# Altium project XDRONE.PrjPcb
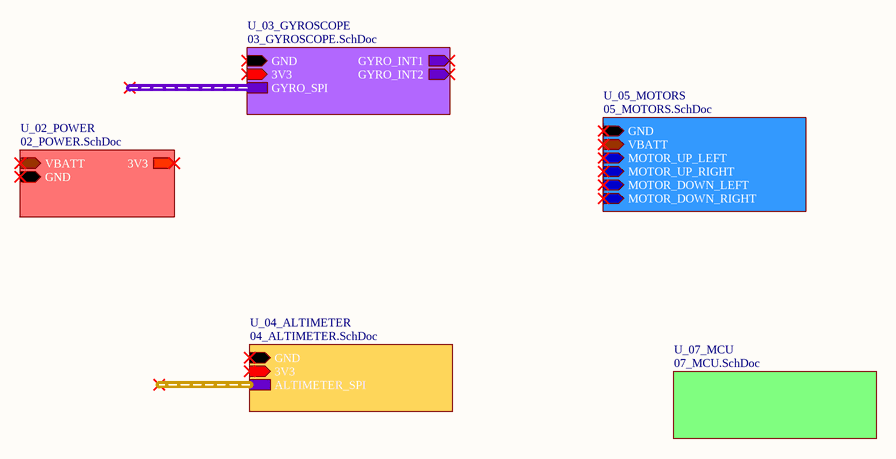
[diagram p0: 01_XDRONE.SchDoc]
5 sheets, 35 parts. Net scope: hierarchical (ports join the sheet entries above them; power ports are global).
Sheets:
  01_XDRONE.SchDoc
    U_02_POWER = 02_POWER.SchDoc
    U_05_MOTORS = 05_MOTORS.SchDoc
    U_03_GYROSCOPE = 03_GYROSCOPE.SchDoc
    U_04_ALTIMETER = 04_ALTIMETER.SchDoc

## Sheet 01_XDRONE.SchDoc: XDRONE
size A4; Author: Gabriel; Organization: Altium Limited; Address1: L3, 12a Rodborough Rd; Address2: Frenchs Forest; Address3: NSW; Address4: Australia 2086; SheetNumber: 1; SheetTotal: 1; Subtitle: Main

### Sub-sheets
U_02_POWER = 02_POWER.SchDoc: VBATT (in), GND (in), 3V3 (out)
U_03_GYROSCOPE = 03_GYROSCOPE.SchDoc: GND (in), 3V3 (in), GYRO_INT1 (out), GYRO_INT2 (out), GYRO_SPI (harness GYRO_SPI)
U_04_ALTIMETER = 04_ALTIMETER.SchDoc: GND (in), 3V3 (in), ALTIMETER_SPI (harness ALTIMETER_SPI)
U_05_MOTORS = 05_MOTORS.SchDoc: GND (in), VBATT (in), MOTOR_UP_LEFT (in), MOTOR_UP_RIGHT (in), MOTOR_DOWN_LEFT (in), MOTOR_DOWN_RIGHT (in)
U_07_MCU = 07_MCU.SchDoc (file not in this document): no entries

### Nets
3V3: sheet U_03_GYROSCOPE/3V3, sheet U_04_ALTIMETER/3V3
GND: sheet U_02_POWER/GND, sheet U_05_MOTORS/GND, sheet U_03_GYROSCOPE/GND, sheet U_04_ALTIMETER/GND

### Notes on the sheet
- TITLE:
- CREATED BY
- MODIFIED DATE
- PAGE
- /

## Sheet 02_POWER.SchDoc: POWER
size A4; Author: Gabriel; Organization: Altium Limited; Address1: L3, 12a Rodborough Rd; Address2: Frenchs Forest; Address3: NSW; Address4: Australia 2086; SheetNumber: 2; SheetTotal: 1; Subtitle: XDRONE
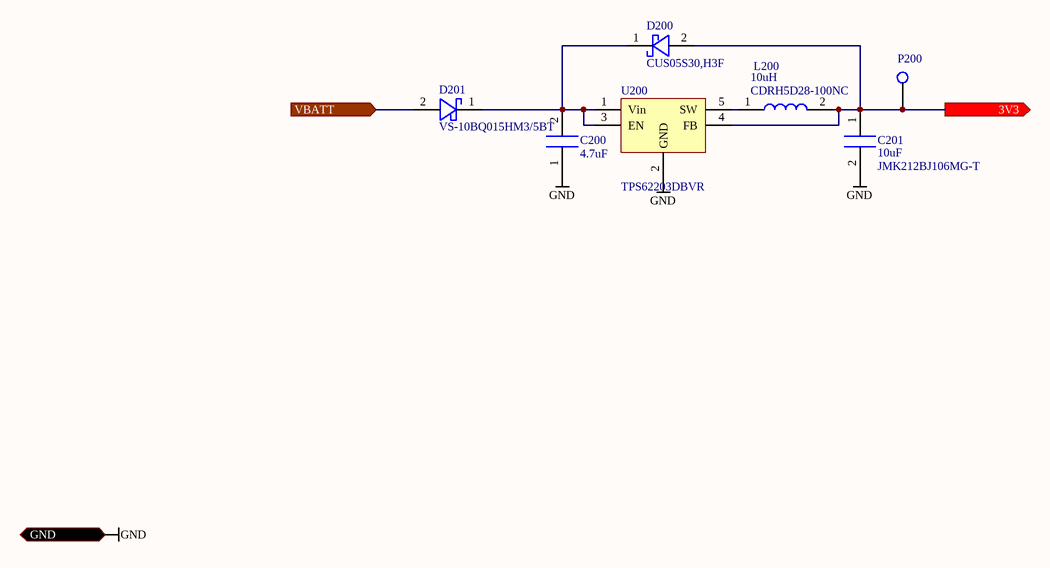
[diagram p1: 02_POWER.SchDoc]

### Parts
C200  value 4.7uF  [CAP_0805]  (hidden comment: 4.7uF_10%_16V_0805_X7R_GRM21BR71C475KE51L)
C201  value 10uF  MANUFACTURER REFERENCE: JMK212BJ106MG-T  [CAP_0805]  (hidden comment: 10uF_20%_6.3V_0805_X5R_JMK212BJ106MG-T)
D200  MANUFACTURER REFERENCE: CUS05S30,H3F  [SOD-323]  (hidden comment: DIODE_30V_500mA_340mVf_CUS05S30,H3F)
D201  MANUFACTURER REFERENCE: VS-10BQ015HM3/5BT  (hidden comment: DIODE_15V_1A_210mVf_VS-10BQ015HM3/5BT)
L200  value 10uH  [CDRH5D28-100NC]  (hidden comment: 10uH_30%_1.3A_CDRH5D28-100NC)
P200  TEST_POINT_2mm  [TEST_POINT_2mm]  (value not drawn)
U200  MANUFACTURER REFERENCE: TPS62203DBVR  [SC-74A-5 SOT-23-5]  (hidden comment: DCDC_6VIN_3.3VOUT_600mA_TPS62203DBVR)

### Ports
3V3 (out), GND (in), VBATT (in)

### Nets
GND: C200.1 C201.2 U200.2(GND) ; port GND
NetC200_2: C200.2 D200.1 D201.1 U200.1(Vin) U200.3(EN)
NetC201_1: C201.1 D200.2 L200.2 P200.1 U200.4(FB) ; port 3V3
NetD201_2: D201.2 ; port VBATT
NetL200_1: L200.1 U200.5(SW)

### Notes on the sheet
- TITLE:
- CREATED BY
- MODIFIED DATE
- PAGE
- /

### Library data of the parts
C200 = 4.7uF_10%_16V_0805_X7R_GRM21BR71C475KE51L: CAP 4.7uF 10% 106 0805 X7R; MANUFACTURER: MURATA; VOLTAGE RATING: 16V; DIELECTRIC: X7R; TOLERANCE: 10%; PACKAGING: 0805; MOUNTING: SMD; MANUFACTURER REFERENCE: GRM21BR71C475KE51L
C201 = 10uF_20%_6.3V_0805_X5R_JMK212BJ106MG-T: CAP 10uF 20% 6.3V 0805 X5R; MANUFACTURER: TAYIO YUDEN; DIELECTRIC: X5R; TOLERANCE: 20%; VOLTAGE RATING: 6.3V; PACKAGING: 0805; MOUNTING: SMD
D200 = DIODE_30V_500mA_340mVf_CUS05S30,H3F: DIODE 30V 500mA 340mVf CUS05S30,H3F; MANUFACTURER: TOSHIBA; FORWARD VOLTAGE: 340mV; TYPE: SCHOTTKY; REVERSE VOLTAGE MAX: 30V; CURRENT MAX: 500mA; PACKAGING: SOD-323; MOUNTING: SMD
D201 = DIODE_15V_1A_210mVf_VS-10BQ015HM3/5BT: DIODE 15V 1A 210mVf VS-10BQ015HM3/5BT; MANUFACTURER: VISHAY; FORWARD VOLTAGE: 210mV; TYPE: SCHOTTKY; REVERSE VOLTAGE MAX: 15V; CURRENT MAX: 1A; PACKAGING: DO-214AA; MOUNTING: SMD
L200 = 10uH_30%_1.3A_CDRH5D28-100NC: INDUCTOR 10uH 30% 1.3A CDRH5D28-100NC; MANUFACTURER: SUMIDA; TOLERANCE: 30%; MOUNTING: SMD; MANUFACTURER REFERENCE: CDRH5D28-100NC; CURRENT RATING: 1.3A
U200 = DCDC_5VIN_3.3VOUT_1A_TPS62203DBVR: DCDC 2-5Vin 3.3Vout 1A 300mA TPS62203DBVR; MANUFACTURER: TI; INPUT VOLTAGE MIN: 2.5V; INPUT VOLTAGE MAX: 6V; OUTPUT VOLTAGE: 3.3V; CURRENT MAX: 300mA; PACKAGING: SOT-23-5; MOUNTING: SMD

## Sheet 05_MOTORS.SchDoc: MOTORS
size A4; Author: Gabriel; Organization: Altium Limited; Address1: L3, 12a Rodborough Rd; Address2: Frenchs Forest; Address3: NSW; Address4: Australia 2086; SheetNumber: 5; SheetTotal: 5; Subtitle: XDRONE
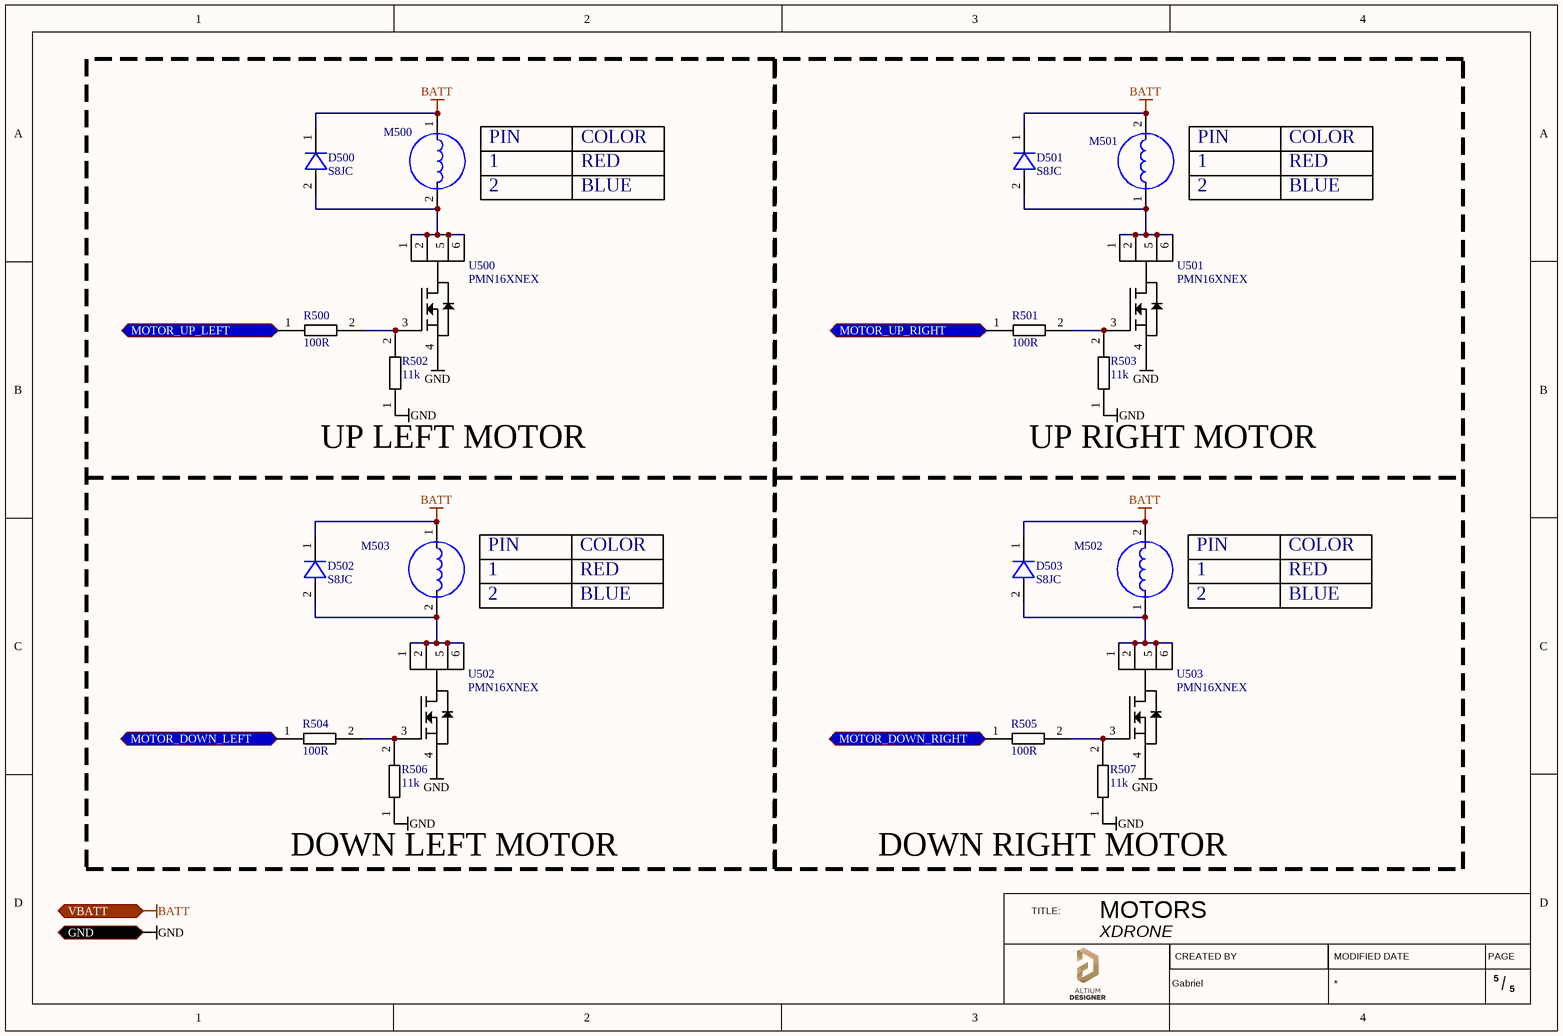
[diagram p2: 05_MOTORS.SchDoc]

### Parts
D500  MANUFACTURER REFERENCE: S8JC  (hidden comment: DIODE_600V_8A_1Vf_S8JC)
D501  MANUFACTURER REFERENCE: S8JC  (hidden comment: DIODE_600V_8A_1Vf_S8JC)
D502  MANUFACTURER REFERENCE: S8JC  (hidden comment: DIODE_600V_8A_1Vf_S8JC)
D503  MANUFACTURER REFERENCE: S8JC  (hidden comment: DIODE_600V_8A_1Vf_S8JC)
M500  BDC_1020_3.7V_4A  (value not drawn)
M501  BDC_1020_3.7V_4A  (value not drawn)
M502  BDC_1020_3.7V_4A  (value not drawn)
M503  BDC_1020_3.7V_4A  (value not drawn)
R500  value 100R  [RES_0402]  (hidden comment: RES_100R_1%_0402_RC0402FR-07100RL)
R501  value 100R  [RES_0402]  (hidden comment: RES_100R_1%_0402_RC0402FR-07100RL)
R502  value 11k  [RES_0402]  (hidden comment: RES_11k_5%_0402_ERJ-2GEJ113X)
R503  value 11k  [RES_0402]  (hidden comment: RES_11k_5%_0402_ERJ-2GEJ113X)
R504  value 100R  [RES_0402]  (hidden comment: RES_100R_1%_0402_RC0402FR-07100RL)
R505  value 100R  [RES_0402]  (hidden comment: RES_100R_1%_0402_RC0402FR-07100RL)
R506  value 11k  [RES_0402]  (hidden comment: RES_11k_5%_0402_ERJ-2GEJ113X)
R507  value 11k  [RES_0402]  (hidden comment: RES_11k_5%_0402_ERJ-2GEJ113X)
U500  MANUFACTURER REFERENCE: PMN16XNEX  (hidden comment: MOS_N_1G_20VDS_6.9A_0.65Vth_PMN16XNEX)
U501  MANUFACTURER REFERENCE: PMN16XNEX  (hidden comment: MOS_N_1G_20VDS_6.9A_0.65Vth_PMN16XNEX)
U502  MANUFACTURER REFERENCE: PMN16XNEX  (hidden comment: MOS_N_1G_20VDS_6.9A_0.65Vth_PMN16XNEX)
U503  MANUFACTURER REFERENCE: PMN16XNEX  (hidden comment: MOS_N_1G_20VDS_6.9A_0.65Vth_PMN16XNEX)

### Ports
GND (in), MOTOR_DOWN_LEFT (in), MOTOR_DOWN_RIGHT (in), MOTOR_UP_LEFT (in), MOTOR_UP_RIGHT (in), VBATT (in)

### Nets
BATT: D500.1 D501.1 D502.1 D503.1 M500.1 M501.2 M502.2 M503.1 ; port VBATT
GND: R502.1 R503.1 R506.1 R507.1 U500.4 U501.4 U502.4 U503.4 ; port GND
NetD500_2: D500.2 M500.2 U500.1 U500.2 U500.5 U500.6
NetD501_2: D501.2 M501.1 U501.1 U501.2 U501.5 U501.6
NetD502_2: D502.2 M503.2 U502.1 U502.2 U502.5 U502.6
NetD503_2: D503.2 M502.1 U503.1 U503.2 U503.5 U503.6
NetR500_1: R500.1 ; port MOTOR_UP_LEFT
NetR500_2: R500.2 R502.2 U500.3
NetR501_1: R501.1 ; port MOTOR_UP_RIGHT
NetR501_2: R501.2 R503.2 U501.3
NetR504_1: R504.1 ; port MOTOR_DOWN_LEFT
NetR504_2: R504.2 R506.2 U502.3
NetR505_1: R505.1 ; port MOTOR_DOWN_RIGHT
NetR505_2: R505.2 R507.2 U503.3

### Notes on the sheet
- (near M500) 1
- (near M500) PIN
- RED
- COLOR
- (near M501) 1
- (near M501) PIN
- 2
- BLUE
- (near R502) UP LEFT MOTOR
- (near R503) UP RIGHT MOTOR
- (near M503) 1
- (near M503) PIN
- (near M502) 1
- (near M502) PIN
- (near R506) DOWN LEFT MOTOR
- (near R507) DOWN RIGHT MOTOR
- TITLE:
- CREATED BY
- MODIFIED DATE
- PAGE
- /

### Library data of the parts
D500-D503 = DIODE_600V_8A_1Vf_S8JC: DIODE 600V 8A 1Vf S8JC; MANUFACTURER: TAIWAN; FORWARD VOLTAGE: 1V; TYPE: NORMAL; REVERSE VOLTAGE MAX: 600V; CURRENT MAX: 8A; PACKAGING: DO-214AB; MOUNTING: SMD
M500-M503 = BDC_1020_3.7V_4A: Brushed DC motor 3.7V; MANUFACTURER: Aliexpress; INPUT VOLTAGE MAX: 3.7; CURRENT MAX: 4A; PACKAGING: 1020; MOUNTING: THT
R500 R501 R504 R505 = RES_100R_1%_0402_RC0402FR-07100RL: RESISTOR 100R 1% 0402 RC0402FR-07100RL; MANUFACTURER: YAGEO; VOLTAGE RATING: 50V; TOLERANCE: 1%; MOUNTING: SMD; MANUFACTURER REFERENCE: RC0402FR-07100RL; PACKAGING: 0402
R502 R503 R506 R507 = RES_11k_5%_0402_ERJ-2GEJ113X: RESISTOR 11k 5% 0402 ERJ-2GEJ113X; MANUFACTURER: PANASONIC; VOLTAGE RATING: 50V; TOLERANCE: 5%; MOUNTING: SMD; MANUFACTURER REFERENCE: ERJ-2GEJ113X; PACKAGING: 0402
U500-U503 = MOS_N_1G_20VDS_6.9A_0.65Vth_PMN16XNEX: MOS N 1G 20VDS 6.9A 0.65Vth PMN16XNEX; MANUFACTURER: NEXPERIA; VOLTAGE DS MAX: 20V; NUMBER OF GATES: 1; VOLTAGE THRESHOLD: 0.65V; CURRENT MAX: 6.9A; PACKAGING: SOT-457; MOUNTING: SMD

## Sheet 03_GYROSCOPE.SchDoc: ACCELEROMETER / GYRO
size A4; Author: Gabriel; Organization: Altium Limited; Address1: L3, 12a Rodborough Rd; Address2: Frenchs Forest; Address3: NSW; Address4: Australia 2086; SheetNumber: 3; SheetTotal: 1; Subtitle: XDRONE
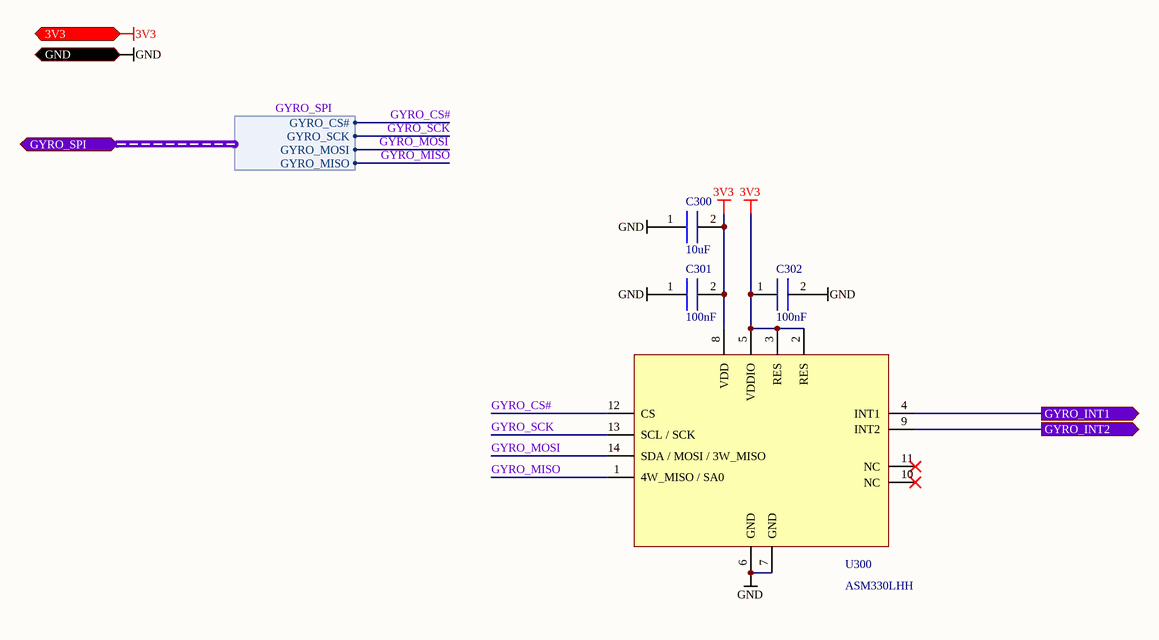
[diagram p3: 03_GYROSCOPE.SchDoc]

### Parts
C300  value 10uF  [CAP_0402]  (hidden comment: 10uF_20%_6.3V_0402_GRM155R60J106ME05D)
C301  value 100nF  [CAP_0402]  (hidden comment: 100nF_10%_16V_0402_GRM155R71C104KA88J)
C302  value 100nF  [CAP_0402]  (hidden comment: 100nF_10%_16V_0402_GRM155R71C104KA88J)
U300  MANUFACTURER REFERENCE: ASM330LHH  (hidden comment: GYRO_3D_3.6V_ACEL_ASM330LHH)

### Ports
3V3 (in), GND (in), GYRO_INT1 (out), GYRO_INT2 (out), GYRO_SPI (harness GYRO_SPI)

### Harnesses
GYRO_SPI: GYRO_CS#, GYRO_SCK, GYRO_MOSI, GYRO_MISO

### Nets
3V3: C300.2 C301.2 C302.1 U300.2(RES) U300.3(RES) U300.5(VDDIO) U300.8(VDD) ; port 3V3
GND: C300.1 C301.1 C302.2 U300.6(GND) U300.7(GND) ; port GND
GYRO_CS#: U300.12(CS) ; port GYRO_SPI.GYRO_CS#
GYRO_MISO: U300.1(4W_MISO_/_SA0) ; port GYRO_SPI.GYRO_MISO
GYRO_MOSI: U300.14(SDA_/_MOSI_/_3W_MISO) ; port GYRO_SPI.GYRO_MOSI
GYRO_SCK: U300.13(SCL_/_SCK) ; port GYRO_SPI.GYRO_SCK
NetU300_4: U300.4(INT1) ; port GYRO_INT1
NetU300_9: U300.9(INT2) ; port GYRO_INT2

Not connected (* = marked no-connect by the designer): U300 10(NC)* 11(NC)*

### Notes on the sheet
- TITLE:
- CREATED BY
- MODIFIED DATE
- PAGE
- /

### Library data of the parts
C300 = 10uF 20% 6.3V 0402 GRM155R60J106ME05D: CAPACITOR 10uF 20% 6.3V 0402 GRM155R60J106ME05D; MANUFACTURER: MURATA; DIELECTRIC: X5R; TOLERANCE: 20%; VOLTAGE RATING: 6.3V; PACKAGING: 0402; MOUNTING: SMD; MANUFACTURER REFERENCE: GRM155R60J106ME05D
C301 C302 = 100nF_10%_16V_0402_GRM155R71C104KA88J: CAPACITOR 100nF 10% X7R 0402; MANUFACTURER: MURATA; DIELECTRIC: X5R; VOLTAGE RATING: 16V; TOLERANCE: 10%; MOUNTING: SMD; MANUFACTURER REFERENCE: GRM155R71C104KA88J; PACKAGING: 0402
U300 = GYRO_3D_3.6V_ACEL_ASM330LHH: Gyroscope and accelerometer 3D 3.6V ASM330LHH; MANUFACTURER: ST; INPUT VOLTAGE MIN: 2V; INPUT VOLTAGE MAX: 3.6V; PACKAGING: 14-LGA; MOUNTING: SMD

## Sheet 04_ALTIMETER.SchDoc
size A4; Author: Gabriel; Organization: Altium Limited; Address1: L3, 12a Rodborough Rd; Address2: Frenchs Forest; Address3: NSW; Address4: Australia 2086; SheetNumber: 1; SheetTotal: 1
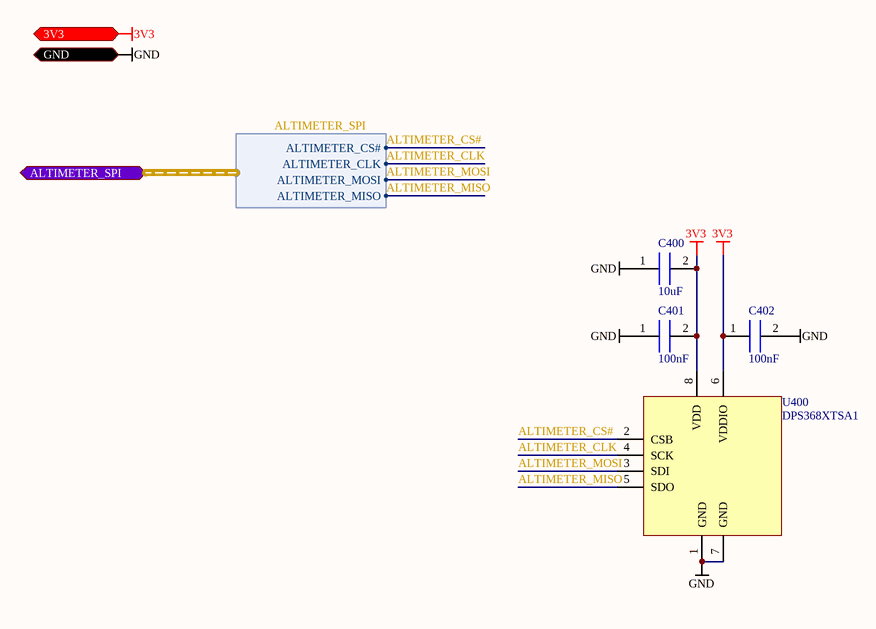
[diagram p4: 04_ALTIMETER.SchDoc]

### Parts
C400  value 10uF  [CAP_0402]  (hidden comment: 10uF_20%_6.3V_0402_GRM155R60J106ME05D)
C401  value 100nF  [CAP_0402]  (hidden comment: 100nF_10%_16V_0402_GRM155R71C104KA88J)
C402  value 100nF  [CAP_0402]  (hidden comment: 100nF_10%_16V_0402_GRM155R71C104KA88J)
U400  MANUFACTURER REFERENCE: DPS368XTSA1  (hidden comment: BAR_4V_0.002hPA_500nA_DPS368XTSA1)

### Ports
3V3 (in), ALTIMETER_SPI (harness ALTIMETER_SPI), GND (in)

### Harnesses
ALTIMETER_SPI: ALTIMETER_MISO, ALTIMETER_MOSI, ALTIMETER_CLK, ALTIMETER_CS#

### Nets
3V3: C400.2 C401.2 C402.1 U400.6(VDDIO) U400.8(VDD) ; port 3V3
GND: C400.1 C401.1 C402.2 U400.1(GND) U400.7(GND) ; port GND
ALTIMETER_CLK: U400.4(SCK) ; port ALTIMETER_SPI.ALTIMETER_CLK
ALTIMETER_CS#: U400.2(CSB) ; port ALTIMETER_SPI.ALTIMETER_CS#
ALTIMETER_MISO: U400.5(SDO) ; port ALTIMETER_SPI.ALTIMETER_MISO
ALTIMETER_MOSI: U400.3(SDI) ; port ALTIMETER_SPI.ALTIMETER_MOSI

### Notes on the sheet
- TITLE:
- CREATED BY
- MODIFIED DATE
- PAGE
- /

### Library data of the parts
C400 = 10uF 20% 6.3V 0402 GRM155R60J106ME05D: as C300 on sheet 03_GYROSCOPE; TOLERANCE: 20%; VOLTAGE RATING: 6.3V; PACKAGING: 0402; MOUNTING: SMD; MANUFACTURER REFERENCE: GRM155R60J106ME05D
C401 C402 = 100nF_10%_16V_0402_GRM155R71C104KA88J: as C301 on sheet 03_GYROSCOPE; TOLERANCE: 10%; MOUNTING: SMD; MANUFACTURER REFERENCE: GRM155R71C104KA88J; PACKAGING: 0402
U400 = BAR_4V_0.002hPA_500nA_DPS368XTSA1: BAROMETRIC SENSOR 4V 0.002hPA 500nA DPS368XTSA1; MANUFACTURER: INFINEON; INPUT VOLTAGE MIN: 1.7V; CURRENT MAX: 350uA; NUMBER OF GATES: 1; INPUT VOLTAGE MAX: 4V; PACKAGING: 8-VFLGA; MOUNTING: SMD

## Nets that join several sheets
3V3: 03_GYROSCOPE (7 pins), 04_ALTIMETER (5 pins)
GND: 02_POWER (C200.1 C201.2 U200.2), 05_MOTORS (8 pins), 03_GYROSCOPE (5 pins), 04_ALTIMETER (5 pins)